# EAGLE design Adafruit Sparkle Motion Stick (EAGLE 9.6.2)
COMPANY: ADAFRUIT INDUSTRIES; DRAWN: KTOWN; REV: B
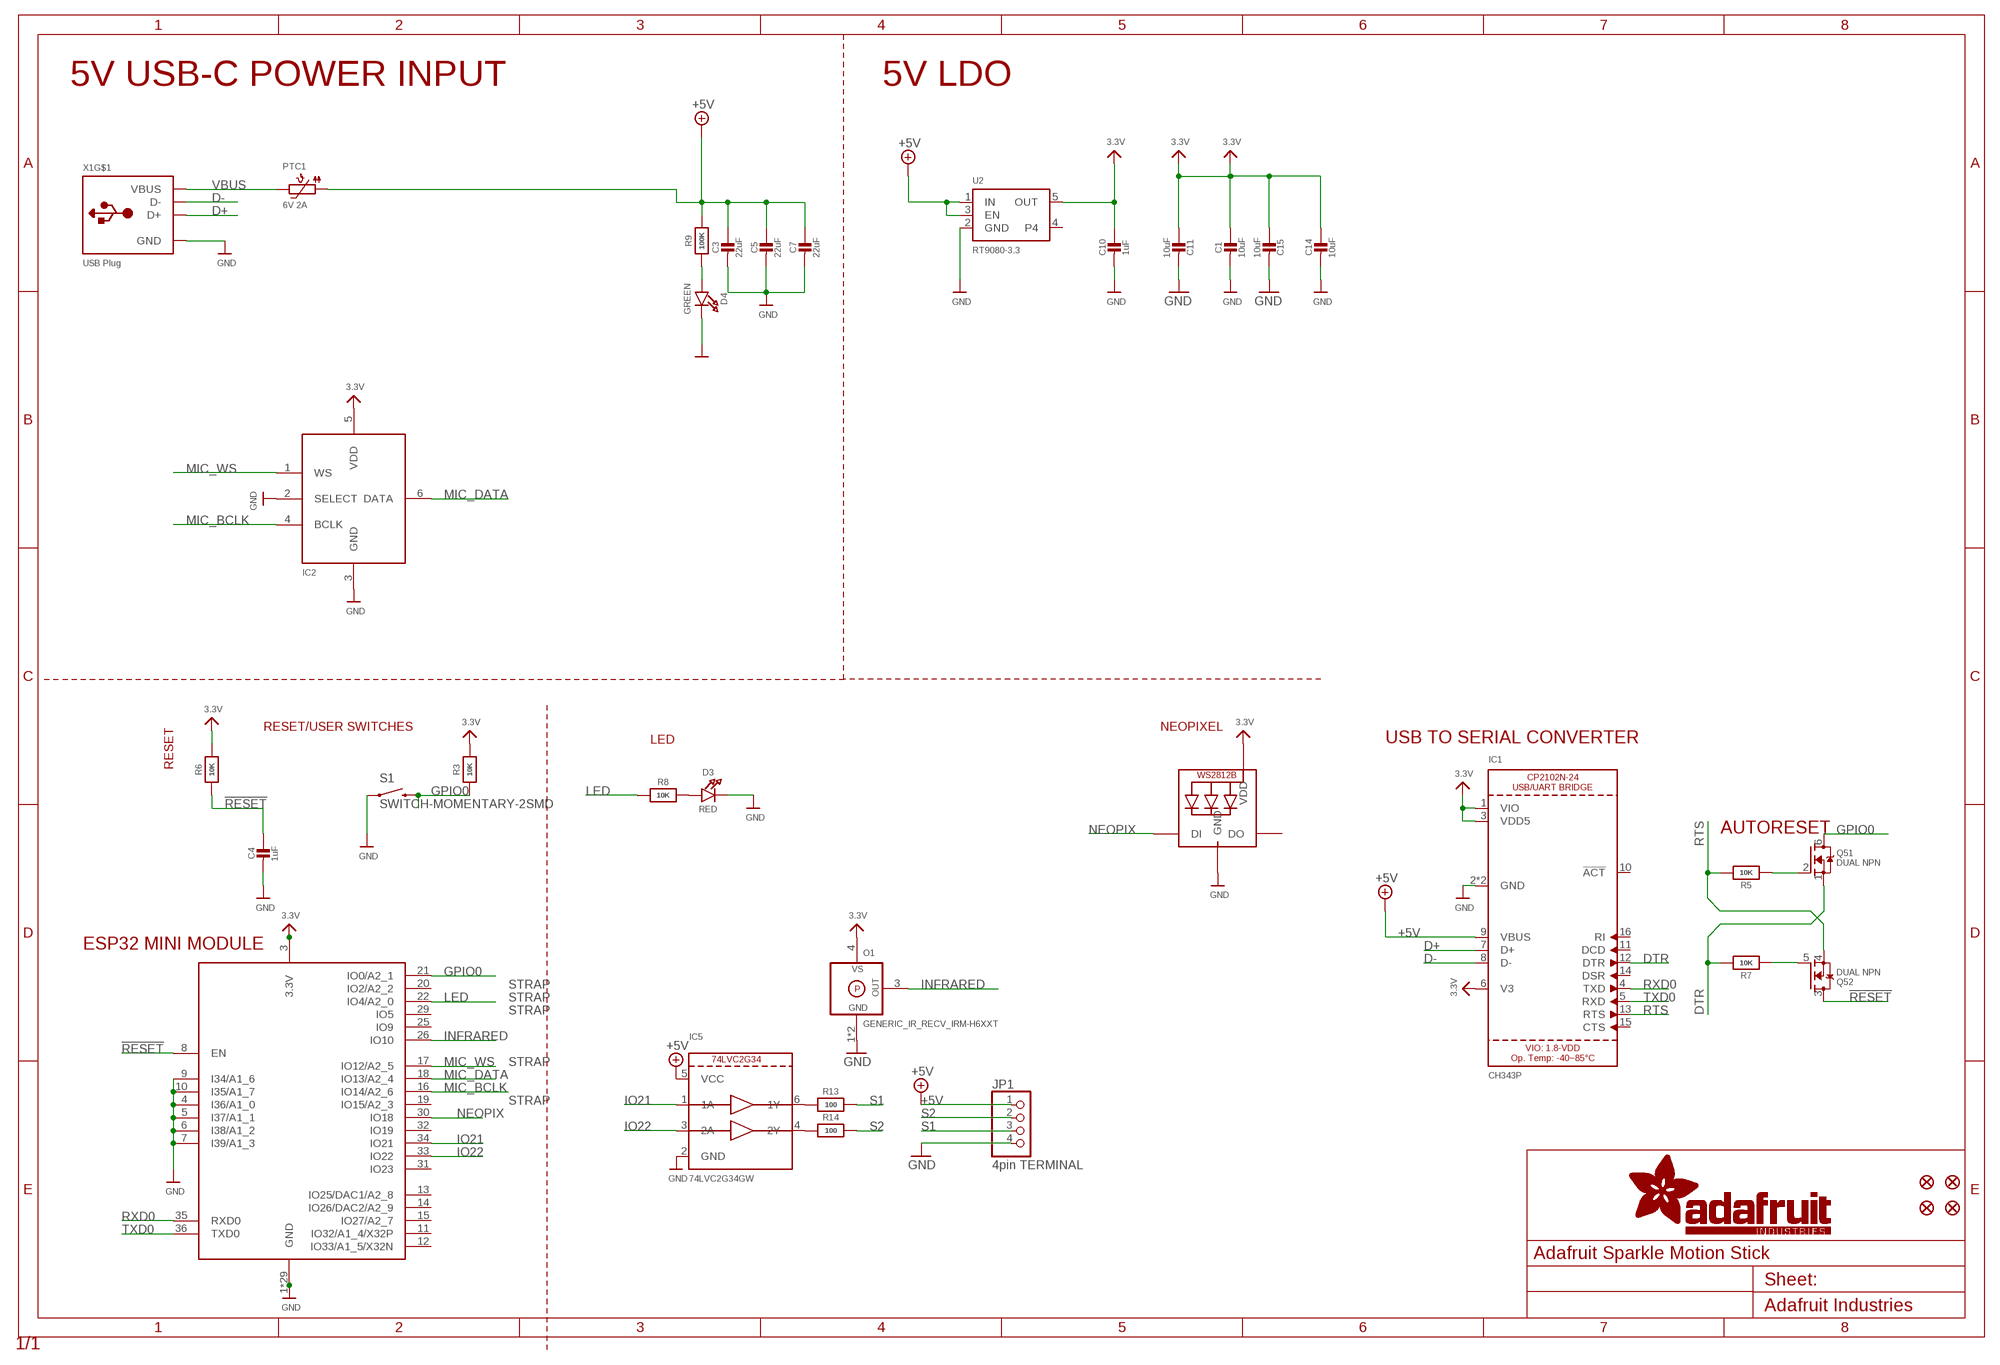
[diagram p0: schematic, sheet 1]

## Parts
C1  10uF  CAP_CERAMIC0805-NOOUTLINE  [0805-NO]
C3  22uF  CAP_CERAMIC0805-NOOUTLINE  [0805-NO]
C4  1uF  CAP_CERAMIC0603_NO  [0603-NO]
C5  22uF  CAP_CERAMIC0805-NOOUTLINE  [0805-NO]
C7  22uF  CAP_CERAMIC0805-NOOUTLINE  [0805-NO]
C10  1uF  CAP_CERAMIC0603_NO  [0603-NO]
C11  10uF  CAP_CERAMIC0805-NOOUTLINE  [0805-NO]
C14  10uF  CAP_CERAMIC0805-NOOUTLINE  [0805-NO]
C15  10uF  CAP_CERAMIC0805-NOOUTLINE  [0805-NO]
D3  RED  LED0603_NOOUTLINE  [CHIPLED_0603_NOOUTLINE]
D4  GREEN  LED0603_NOOUTLINE  [CHIPLED_0603_NOOUTLINE]
IC1  CH343P  [QFN16_3MM]
IC2  ICS-43434  MIC_I2S_SPH0645  [SPH0645LM4H]
IC5  74LVC2G34GW  [SC70-6L]
JP1  4pin TERMINAL  HEADER-1X4_254MMTERM  [1X04_2.54MMTERMINAL]
LED1  WS2812B_SK6805_1515  [SK6805_1515]
O1  GENERIC_IR_RECV_IRM-H6XXT  [IRM-H6XXT]
PTC1  6V 2A  PTC_0805  [0805-NO]
Q5  DUAL NPN  MOSFET-N_DUAL  [SOT363]
R3  10K  RESISTOR_0603_NOOUT  [0603-NO]
R5  10K  RESISTOR_0603_NOOUT  [0603-NO]
R6  10K  RESISTOR_0603_NOOUT  [0603-NO]
R7  10K  RESISTOR_0603_NOOUT  [0603-NO]
R8  10K  RESISTOR_0603_NOOUT  [0603-NO]
R9  100K  RESISTOR_0603_NOOUT  [0603-NO]
R13  100  RESISTOR_0603_NOOUT  [0603-NO]
R14  100  RESISTOR_0603_NOOUT  [0603-NO]
S1  SWITCH-MOMENTARY-2SMD  [TACTILE_SWITCH_SMD]
U2  RT9080-3.3  VREG_SOT23-5  [SOT23-5]
U$23  FIDUCIAL_0.5MM  [FIDUCIAL_0.5MM]
U$25  FIDUCIAL_0.5MM  [FIDUCIAL_0.5MM]
U$34  FIDUCIAL_0.5MM  [FIDUCIAL_0.5MM]
U$35  FIDUCIAL_0.5MM  [FIDUCIAL_0.5MM]
X1  USB Plug  USB_TYPEA_UG04DD  [USB_A-UGO4DD]
X4  ESP32-MINI-1  [ESP32-MINI-1]

## Nets
3.3V: C1.1 C10.1 C11.1 C14.1 C15.1 IC1.1(VIO) IC1.3(VDD5) IC1.6(V3) IC2.5(VDD) LED1.2(VDD) O1.4(VS) R3.2 R6.2 U2.5(OUT) X4.3(3.3V)
!RESET: C4.1 Q5.3(2:D) R6.1 X4.8(EN)
+5V: C3.1 C5.1 C7.1 IC1.9(VBUS) IC5.5(VCC) JP1.1 PTC1.1 R9.2 U2.1(IN) U2.3(EN)
D+: IC1.7(D+) X1.D+
D-: IC1.8(D-) X1.D-
DTR: IC1.12(DTR) Q5.1(1:S) R7.2
GND: C1.2 C3.2 C4.2 C5.2 C7.2 C10.2 C11.2 C14.2 C15.2 D3.C D4.C IC1.2(GND) IC1.THERMAL(GND) IC2.2(SELECT) IC2.3(GND) IC5.2(GND) JP1.4 LED1.4(GND) O1.1(GND) O1.2(GND) S1.1 U2.2(GND) X1.GND X4.1(GND) X4.2(GND) X4.4(I36/A1_0) X4.5(I37/A1_1) X4.6(I38/A1_2) X4.7(I39/A1_3) X4.9(I34/A1_6) X4.10(I35/A1_7) X4.27(GND) X4.38(GND) X4.39(GND) X4.40(GND) X4.41(GND) X4.42(GND) X4.43(GND) X4.44(GND) X4.45(GND) X4.46(GND) X4.47(GND) X4.48(GND) X4.49(GND) X4.50(GND) X4.51(GND) X4.52(GND) X4.53(GND) X4.54(GND) X4.55(GND) X4.56(GND) X4.57(GND) X4.58(GND) X4.59(GND) X4.60(GND) X4.61(GND) X4.62(GND) X4.63(GND)
GPIO0: Q5.6(1:D) R3.1 S1.3 X4.21(IO0/A2_1)
INFRARED: O1.3(OUT) X4.26(IO10)
IO21: IC5.1(1A) X4.34(IO21)
IO22: IC5.3(2A) X4.33(IO22)
LED: R8.1 X4.22(IO4/A2_0)
MIC_BCLK: IC2.4(BCLK) X4.16(IO14/A2_6)
MIC_DATA: IC2.6(DATA) X4.18(IO13/A2_4)
MIC_WS: IC2.1(WS) X4.17(IO12/A2_5)
N$1: D3.A R8.2
N$2: D4.A R9.1
N$7: Q5.5(2:G) R7.1
N$8: Q5.2(1:G) R5.1
N$10: IC5.6(1Y) R13.1
N$11: IC5.4(2Y) R14.1
NEOPIX: LED1.1(DI) X4.30(IO18)
RTS: IC1.13(RTS) Q5.4(2:S) R5.2
RXD0: IC1.4(TXD) X4.35(RXD0)
S1: JP1.3 R13.2
S2: JP1.2 R14.2
TXD0: IC1.5(RXD) X4.36(TXD0)
VBUS: PTC1.2 X1.VBUS
Unconnected: IC1.10(!ACT) IC1.11(DCD) IC1.14(DSR) IC1.15(CTS) IC1.16(RI) LED1.3(DO) U2.4 X1.MNT1(MT) X1.MNT2(MT) X4.11(IO32/A1_4/X32P) X4.12(IO33/A1_5/X32N) X4.13(IO25/DAC1/A2_8) X4.14(IO26/DAC2/A2_9) X4.15(IO27/A2_7) X4.19(IO15/A2_3) X4.20(IO2/A2_2) X4.25(IO9) X4.29(IO5) X4.31(IO23) X4.32(IO19)

## Notes on the sheet
- 5V USB-C POWER INPUT | 5V LDO
- RESET/USER SWITCHES | NEOPIXEL
- LED | USB TO SERIAL CONVERTER
- RESET
- AUTORESET
- ESP32 MINI MODULE
- STRAP
- STRAP
- STRAP
- STRAP
- STRAP

## Library data of the parts
C1 C3-C5 C7 C10 C11 C14 C15 = microbuilder:CAP_CERAMIC: Ceramic Capacitors For new designs, use the packages preceded by an '_' character since they are more reliable: The following footprints should be used on most boards: _0402 - Standard footprint for regular board layouts _0603 - Standard footprint for regular board layouts _0805 - Standard footprint for regular board layouts _1206 - Standard footprint for regular board layouts For extremely tight-pitch boards where space is at a premium, the following 'micro-pitch' footprints can be used (smaller pads, no silkscreen outline, etc.): _0402MP - Micro-pitch footprint for very dense/compact boards _0603MP - Micro-pitch footprint for very dense/compact boards _0805MP - Micro-pitch footprint for very dense/compact boards _1206MP - Micro-pitch footprint for very dense/compact boards
D3 D4 = microbuilder:LED: LED 0603 - 0603 Surface Mount Package 2mA: Green LED - Low Power (3.9mcd, 2ma, 1.7Vf) - Digikey: 475-2709-2-ND Orange LED - Low Power (9.8mcd, 2ma, 1.8Vf) - Digikey: 475-1194-2-ND Red LED - Low Power (5mcd, 2ma, 1.8Vf) - Digikey: 475-1195-2-ND Yellow LED - Low Power (7mcd, 2ma, 1.8Vf) - Digikey: 475-1196-2-ND 5mA: Blue LED - Low Power (17mcd, 5ma, 2.9Vf) - Digikey: LNJ937W8CRACT-ND 0805 - 0805 Surface Mount Package 2mA: Red LED (8.8mcd, 2mA, 1.8Vf, Clear) - Low Power [Digikey: 475-2510-1-ND] Green LED (5mcd, 2mA, 1.8Vf, Clear) - Low Power [Digikey: 475-2730-1-ND] Yellow LED (11.3mcd, 2mA, 1.8Vf, Clear) - Low Power [Digikey: 475-2555-1-ND] 20mA: Red LED (104mcd, 20mA, Diffused) - LS R976 [Digikey: 475-1278-6-ND] Red LED (12mcd, 20mA, 2.0Vf, Clear) - APT2012EC [Digikey: 754-1128-1-ND] Green LED (15mcd, 20mA, 2.2Vf, Clear) - APT2012GC [Digikey: 754-1131-1-ND] Orange LED (160mcd, 20mA, 2.1Vf, Clear) - APT2012SECK [Digikey: 754-1130-1-ND] 1206 - 1206 Surface Mount Package Green LED (26mcd, 20mA, Diffused) - LG N971 [Digikey: 475-1407-6-ND] Red LED (15mcd, 20mA, Diffused) - LH N974 [Digikey: 475-1416-6-ND] Cree - Cree High-Power Surface Mount LEDs XPEBWT-L1-0000-00D50 - White 111lm 350mA 2.9Vf 6200K 110° XTEAWT-00-0000-00000LEE3 - White 114lm 350mA 2.85Vf 5000K 115° Everlight - Everlight 45-21 Series Surface Mount LEDs 45-21/QK2C-B2832AC2CB2/2T - Warm White 2000mcd 20mA 3.25Vf 3050K 120° 45-21/LK2C-B38452C4CB2/2T - Nuetral White 2000mcd 20mA 3.25Vf 4150K 120° 45-21/LK2C-B50634C6CB2/2T - Cold White 2200mcd 20mA 3.25Vf 5650K 120° PLCC2 Reverse Mount LS T77K-J1L2-1-0-2-R18-Z - Red 11.25mcd 2mA 1.8Vf 630nm 120° LO T77K-L1M2-24-Z - Orange 19.6mcd 2mA 1.8Vf 606nm 120° LY T77K-K2M1-26-Z - Yellow 15.7mcd 2mA 1.8Vf 587nm 120°; ROT: 270
IC1 = microbuilder:CH343P
IC2 = microbuilder:MIC_I2S
IC5 = microbuilder:74LVC2G34
JP1 = microbuilder:HEADER-1X4: PIN HEADER
LED1 = microbuilder:WS2812B; LCSC: C2890035
O1 = adafruit_sensor:GENERIC_IR_RECV
PTC1 = microbuilder:PTC: PTC (Resettable Fuse) 1206 Package 250mA PTC (16V Max, Time-to-Trip: 0.08s) - Digikey: F2110CT-ND 1210 Package 100mA PTC (30V Max, Time-to-Trip: 0.6s) - Digikey: MF-USMF010-2CT-ND 1812 Package 750mA PTC (24V Max, Time-to-Trip: 0.2s) - Digikey: MF-MSMF075/24-2CT-ND
Q5 = microbuilder:MOSFET-N_DUAL: Dual N-Channel MOSFET SOT363 (2.0x1.25mm) 2N7002PS - 60V, 320mA [Digikey: 568-5984-1-ND]; JLC_ROTATION: 90
R3 R5-R9 R13 R14 = microbuilder:RESISTOR: Resistors For new designs, use the packages preceded by an '_' character since they are more reliable: The following footprints should be used on most boards: _0402 - Standard footprint for regular board layouts _0603 - Standard footprint for regular board layouts _0805 - Standard footprint for regular board layouts _1206 - Standard footprint for regular board layouts For extremely tight-pitch boards where space is at a premium, the following 'micro-pitch' footprints can be used (smaller pads, no silkscreen outline, etc.): _0402MP - Micro-pitch footprint for very dense/compact boards _0603MP - Micro-pitch footprint for very dense/compact boards _0805MP - Micro-pitch footprint for very dense/compact boards _1206MP - Micro-pitch footprint for very dense/compact boards
S1 = SparkFun:SWITCH-MOMENTARY-2
U2 = adafruit_power:VREG_SOT23-5: SOT23-5 Fixed Voltage Regulators Part Current Out V Out V In V Dropout θJA (°C/W) TJ (°C) Digikey Part No. ADP121 150mA 3.3V 3.4-5.5V 0.09V @ 150mA -- -- ADP121-AUJZ33R7CT-ND ADP121 150mA 3.0V 3.1-5.5V 0.09V @ 150mA -- -- ADP121-AUJZ30R7CT-ND ADP122 300mA 3.3V 3.4-5.5V 0.085V @ 300mA -- -- ADP122AUJZ-3.3-R7CT-ND ADP1712 300mA 3.3V 3.5-5.5V 0.17V @ 300mA -- -- ADP1712AUJZ-3.3-R7TR-ND AP7311 (Low Cost) 150mA 3.3V 3.5-6V 0.15V @ 150mA -- -- AP7311-33WG-7DICT-ND LD39015M18R 150mA 1.8V 1.9V-5.5V 0.08V @ 100mA -- -- 497-6977-1-ND LP2985A-33DBVR 150mA 3.3V 3.3-16V 0.28V @ 150mA 206 150 296-18479-1-ND MCP1824T-3302E/OT 300mA 3.3V 3.5V-6V 0.2V @ 300mA -- -- MCP1824T-3302E/OTCT-ND MIC5205-2.5YM5 TR 150mA 2.5V 2.7-16V 0.165V @ 150mA -- -- 576-1257-2-ND MIC5205-3.0YM5 TR 150mA 3.0V 3.2V-16V 0.165V @ 150mA -- -- 576-1258-2-ND MIC5205-3.3YM5 TR 150mA 3.3V 3.5V-16V 0.165V @ 150mA -- -- 576-1259-2-ND TPS780330220 150mA 3.3V+2.2V 3.6-5.5V 250mV Max -- -- 296-23332-1-ND TDA3663/N1,135 100mA 3.3V 3.5-45V 0.18V @ 50mA -- -- 568-5343-1-ND Max operating temp can be calculated using θJA, TJ (max junction temperature), and power in watts. Set the "Maximum Ambient Temperature" until it reaches TJ ("Max Junction Temperature"), which is the absolute limit for safe use of the regulator: Heat Sink Temperature Calculator <http://www.daycounter.com/Calculators/Heat-Sink-Temperature-Calculator.phtml> For example, With 12V source into a 3.3V LP2985 and a 30mA load, we are dissipating (12V-3.3V) * 0.03A = 0.261W. With a θJA of 206 °C/W, a TJ of 150°C, and 261mW we can safely use the chip without a heat sink up to 75°C (=147.1°C Junction Temperature).; JLC_ROTATION: 0
U$23 U$25 U$34 U$35 = microbuilder:FIDUCIAL: Fiducial Alignment Points Various fiducial points for machine vision alignment.
X1 = adafruit_electromech:USB_TYPEA: USB - Type A Connectors Male types stick out and are inserted into a PC or matching females parts (these are the connectors used on USB Memory Sticks, etc.). Female parts are generally used for USB Host and accept a male-type connector. SMT - 4UCON: 10017 PTHFML - Digikey: 609-1045-ND, 4UCon: 05241 PCB - Use 2.0mm thick PCBs with this footprint
X4 = adafruit_wireless:ESP32-MINI-1

## Net classes
1 power: width 0.305 mm

## Board
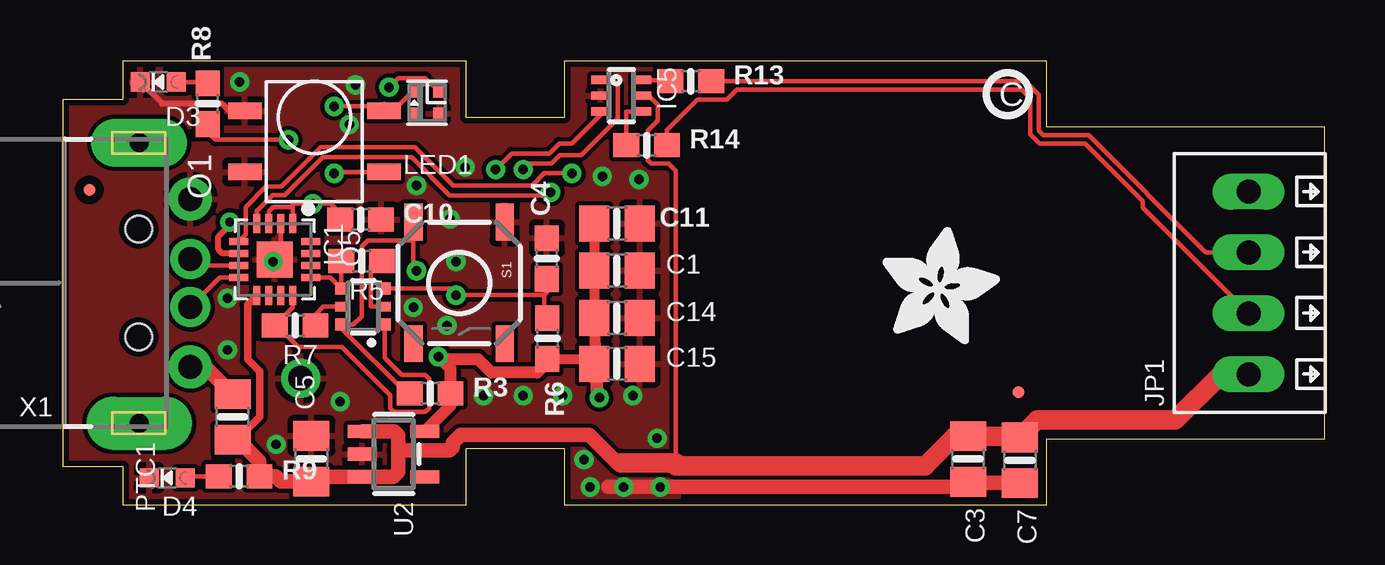
[diagram p1: board, top side]
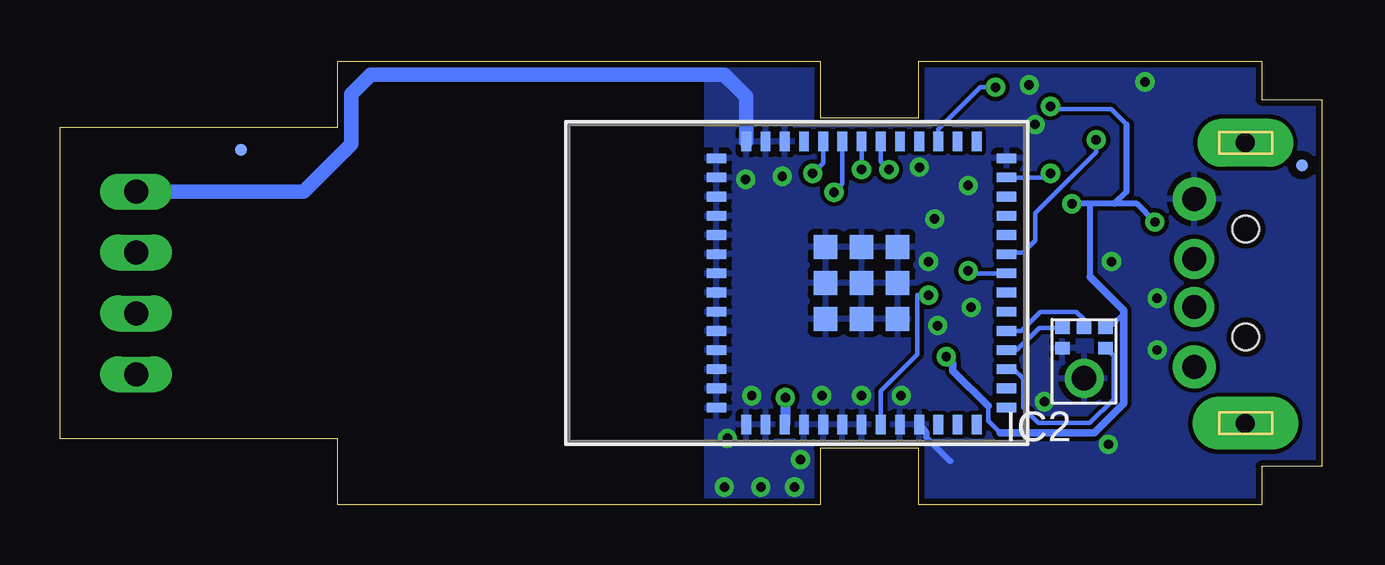
[diagram p2: board, bottom side, seen from below]

Size 52.57 x 18.5 mm. Coordinates in mm from the lower left corner, seen from the top.
Outline: 0,16.9 0,1.6 2.5,1.6 2.5,0 16.8,0 16.8,2.35 20.9,2.35 20.9,0 41,0 41,2.75 52.57,2.75 52.57,15.75 41,15.75 41,18.5 20.9,18.5 20.9,16.15 16.8,16.15 16.8,18.5 2.5,18.5 2.5,16.9 0,16.9
Copper layers (1*16): Top 0.035mm / dielectric 1.5mm / Bottom 0.035mm
Design rules "adafruit 7-7": minimum track width 7mil, minimum drill 15.5mil, track to track 7mil, track to pad 7mil, pad to pad 7mil, via to via 7mil, smd to smd 7mil, copper to edge 10mil, drill to drill 8mil, minimum pad ring 10mil, minimum via ring 8mil, stop-mask expansion 2mil, vias tented up to drill 20mil, thermal gap 10mil

### Footprints (pad centres in the part's own frame; a part is rotated, then mirrored left to right if it is on the bottom)
0805-NO = smd 1.24 x 1.5: 1 -0.95,0; 2 0.95,0
0603-NO = smd 1.075 x 1: 1 -0.85,0; 2 0.85,0
CHIPLED_0603_NOOUTLINE = smd 0.8 x 0.8: A 0,-0.75; C 0,0.75
QFN16_3MM = smd 0.8 x 0.28: 1 -1.5,0.75; 2 -1.5,0.25; 3 -1.5,-0.25; 4 -1.5,-0.75; 9 1.5,-0.75; 10 1.5,-0.25; 11 1.5,0.25; 12 1.5,0.75 | smd 0.28 x 0.8: 5 -0.75,-1.5; 6 -0.25,-1.5; 7 0.25,-1.5; 8 0.75,-1.5; 13 0.75,1.5; 14 0.25,1.5; 15 -0.25,1.5; 16 -0.75,1.5 | smd 1.5 x 1.5: THERMAL 0,0
SPH0645LM4H = smd 0.6 x 0.525: 1 -0.9,1.4; 2 -0.9,0.55; 4 0.9,0.55; 5 0.9,1.4; 6 0,1.4 | drill 1.025 pad 1.625: 3 0,-0.71
SC70-6L = smd 0.35 x 0.8: 1 -0.65,-0.85; 2 0,-0.85; 3 0.65,-0.85; 4 0.65,0.85; 5 0,0.85; 6 -0.65,0.85
1X04_2.54MMTERMINAL = drill 1 long: 1 -3.81,0; 2 -1.27,0; 3 1.27,0; 4 3.81,0
SK6805_1515 = smd 0.5 x 0.5: 1 -0.5,-0.45; 2 0.5,-0.45; 3 0.5,0.45; 4 -0.5,0.45
IRM-H6XXT = smd 0.7 x 1.4: 1 1.27,2.9; 2 -1.27,2.9; 3 -1.27,-2.9; 4 1.27,-2.9
SOT363 = smd 0.5 x 0.5: 1 -0.75,-0.9; 3 0.75,-0.9; 4 0.75,0.9; 6 -0.75,0.9 | smd 0.4 x 0.5: 2 0,-0.9; 5 0,0.9
TACTILE_SWITCH_SMD = smd 1.524 x 0.762: 1 -2.54,1.905; 2 2.54,1.905; 3 -2.54,-1.905; 4 2.54,-1.905
SOT23-5 = smd 0.55 x 1.2: 1 -0.95,-1.3; 2 0,-1.3; 3 0.95,-1.3; 4 0.95,1.3; 5 -0.95,1.3
FIDUCIAL_0.5MM = smd 0.5 x 0.5: 1 0,0
USB_A-UGO4DD = drill 1 pad 1.676: D+ -1,2.15; D- 1,2.15 | drill 1 pad 1.778: GND -3.5,2.15; VBUS 3.5,2.15 | drill 0.8 pad 2.2 long: MNT1 5.85,0.02 | drill 0.8 pad 2 long: MNT2 -5.85,0.02 | hole 1.1: 2.25,0; -2.25,0
ESP32-MINI-1 = smd 0.813 x 0.406: 1 -5.9,4.9; 2 -5.9,4.1; 3 -5.9,3.3; 4 -5.9,2.5; 5 -5.9,1.7; 6 -5.9,0.9; 7 -5.9,0.1; 8 -5.9,-0.7; 9 -5.9,-1.5; 10 -5.9,-2.3; 11 -5.9,-3.1; 12 -5.9,-3.9; 13 -5.9,-4.7; 28 5.9,-4.7; 29 5.9,-3.9; 30 5.9,-3.1; 31 5.9,-2.3; 32 5.9,-1.5; 33 5.9,-0.7; 34 5.9,0.1; 35 5.9,0.9; 36 5.9,1.7; 37 5.9,2.5; 38 5.9,3.3; 39 5.9,4.1; 40 5.9,4.9 | smd 0.406 x 0.813: 14 -5.2,-5.95; 15 -4.4,-5.95; 16 -3.6,-5.95; 17 -2.8,-5.95; 18 -2,-5.95; 19 -1.2,-5.95; 20 -0.4,-5.95; 21 0.4,-5.95; 22 1.2,-5.95; 23 2,-5.95; 24 2.8,-5.95; 25 3.6,-5.95; 26 4.4,-5.95; 27 5.2,-5.95; 41 5.2,6.15; 42 4.4,6.15; 43 3.6,6.15; 44 2.8,6.15; 45 2,6.15; 46 1.2,6.15; 47 0.4,6.15; 48 -0.4,6.15; 49 -1.2,6.15; 50 -2,6.15; 51 -2.8,6.15; 52 -3.6,6.15; 53 -4.4,6.15; 54 -5.2,6.15 | smd 0.991 x 0.991: 55 -1.5,1.6; 56 0,1.6; 57 1.5,1.6; 58 -1.5,0.1; 59 0,0.1; 60 1.5,0.1; 61 -1.5,-1.4; 62 0,-1.4; 63 1.5,-1.4

### Placement (x,y rotation side)
C1  23.09,9.77 0 top
C3  37.72,1.91 270 top
C4  20.17,10.27 90 top
C5  10.35,1.92 90 top
C7  39.88,1.86 270 top
C10  12.41,11.89 0 top
C11  23.09,11.73 0 top
C14  23.09,7.79 0 top
C15  23.09,5.88 0 top
D3  3.98,17.63 90 top
D4  4.34,1.12 90 top
E$1  [ADAFRUIT_5MM]  34.16,6.71 0 top
IC1  8.83,10.23 270 top
IC2  9.9,5.98 0 bottom
IC5  23.27,17.06 270 top
JP1  49.4,9.25 90 top
LED1  15.18,16.77 180 top
O1  10.48,15.15 90 top
PLABEL0  [PLABEL0]  15.47,12.55 0 top
PLABEL1  [PLABEL1]  6.95,14.65 0 top
PLABEL2  [PLABEL2]  26.1,12.43 0 top
PLABEL3  [PLABEL3]  43.54,5.38 0 top
PLABEL4  [PLABEL4]  12.32,16.7 0 top
PLABEL5  [PLABEL5]  11.43,5.4 0 top
PLABEL6  [PLABEL6]  40.04,12.49 0 top
PLABEL7  [PLABEL7]  42.14,7.09 0 top
PLABEL8  [PLABEL8]  42.2,9.82 0 top
PLABEL9  [PLABEL9]  5.78,1.78 90 top
PLABEL10  [PLABEL10]  6.69,12.36 0 top
PLABEL11  [PLABEL11]  16.6,14.65 0 top
PLABEL12  [PLABEL12]  13.55,14.65 0 top
PLABEL13  [PLABEL13]  4.51,16.32 90 top
PLABEL14  [PLABEL14]  26.03,0.7 0 top
PLABEL15  [PLABEL15]  35.94,9.25 90 bottom
PLABEL16  [PLABEL16]  46.1,13.06 0 bottom
PLABEL17  [PLABEL17]  46.23,10.52 0 bottom
PLABEL18  [PLABEL18]  46.23,7.98 0 bottom
PLABEL19  [PLABEL19]  46.35,5.31 0 bottom
PLABEL20  [PLABEL20]  8.64,11.92 90 bottom
PLABEL21  [PLABEL21]  8.51,2.39 0 bottom
PTC1  7.07,3.66 90 top
Q5  12.51,8.26 90 top
R3  15.3,4.64 0 top
R5  12.45,10.16 180 top
R6  20.19,6.93 270 top
R7  9.68,7.47 180 top
R8  6.03,16.72 90 top
R9  7.34,1.19 0 top
R13  26.16,17.66 0 top
R14  24.32,14.99 0 top
S1  16.51,9.25 270 top
U2  13.78,2.11 270 top
U$10  [PCBFEAT-REV-040]  39.37,17.12 0 top
U$23  45.02,14.8 0 bottom
U$25  0.82,14.16 0 bottom
U$34  39.81,4.7 270 top
U$35  1.1,13.13 270 top
X1  3.16,9.25 270 top
X4  19.07,9.25 90 bottom

### Tracks (layer width: path | path; a pad name or v marks a point on that pad's centre or on a via)
3.3V  (via drill 0.39)
  Top 0.178: LED1.2 14.55,17.22 13.72,16.39 13.38,16.72 O1.4 13.19,16.62 v11.3,16.62 | 9.58,12.43 9.58,12.55 v10.41,12.55 11.15,12.55 11.56,12.15 C10.1 | 9.58,12.43 IC1.1 | IC1.3 8.58,12.24 8.76,12.43 9.58,12.43 | v15.64,6.18 15.81,6.01
  Top 0.254: v6.95,11.79 6.95,11.66 6.48,11.19 6.48,10.65 6.65,10.48 IC1.6
  Top 0.406: 22.12,6.08 22.21,6.08 C14.1 22.31,4.51 v22.35,4.46 22.22,4.6 C15.1 | 22.12,6.08 22.14,6.09 C1.1 C11.1 | R6.2 20.32,6.08 22.12,6.08
  Top 0.508: 20.32,6.08 19.76,5.52 17.86,5.52 17.3,6.08 15.88,6.08 15.81,6.01 16.15,5.67 R3.2 16.15,4.14 U2.5
  Bottom 0.178: 10.29,12.55 v10.41,12.55 | 8.13,15.85 8.76,16.49 11.18,16.49 v11.3,16.62 | 13.4,3 13.9,3.5 13.9,4.12 | IC2.5 8.85,7.38 8.26,7.98
  Bottom 0.254: v6.95,11.79 7.71,12.55 8.64,12.55 | 8.64,12.55 9.65,12.55 | 9.65,12.55 10.29,12.55 | 8.64,12.55 8.13,13.06 8.13,15.85 | 9.65,9.5 9.65,12.55
  Bottom 0.305: v15.64,6.18 15.37,5.9 15.37,5.58 13.9,4.12 | 13.4,3 9.49,3 8.26,4.23 8.26,7.98 8.26,8.11 9.65,9.5
  Bottom 0.406: v22.35,4.46 22.35,3.37 X4.3
!RESET  (via drill 0.39)
  Top 0.178: 20.07,8.74 20.17,8.84 C4.1 | 20.07,8.74 v16.38,8.74 16.12,9.01 Q5.3 | R6.1 20.07,7.9 20.07,8.74
  Bottom 0.178: X4.8 18.38,4.75 16.85,6.27 16.85,8.74 v16.38,8.74
+5V
  Top 0.178: IC5.5 24.42,17.06 24.78,16.7 24.78,16.02 24.37,15.6 24.37,14.35 24.4,14.35 24.52,14.22 25.25,14.22 25.54,13.93 25.54,1.76 25.54,1.63
  Top 0.305: PTC1.1 7.26,2.71 8.2,3.66 8.2,5.55 7.7,6.06 7.7,8.35 IC1.9
  Top 0.61: U2.1 13.81,3.06 13.97,2.9 13.97,2.26 | 13.97,2.26 13.97,1.38 13.76,1.16 U2.3 10.54,1.16 C5.1 9.08,0.97 8.87,1.19 R9.2 8.19,1.82 7.3,2.71 PTC1.1 | 13.97,2.26 16.11,2.26 16.24,2.39 16.24,2.58 16.57,2.91 21.94,2.91 23.09,1.76 23.24,1.76
  Top 0.813: JP1.1 48.26,5.44 46.35,3.54 40.6,3.54 C7.1 39.83,2.86 C3.1 37.17,2.86 35.94,1.63 25.54,1.63 | 23.24,1.76 25.54,1.76
D+
  Top 0.178: IC1.7 5.58,9.98 X1.D+
D-
  Top 0.178: IC1.8 6.54,9.48 X1.D-
DTR
  Top 0.178: Q5.1 13.41,6.13 14.13,5.41 15.1,5.41 15.26,5.25 15.26,4.03 15.1,3.87 13.8,3.87 13.65,4.03 13.65,4.56 11.63,6.58 9.8,6.58 8.94,7.45 R7.2 9.58,8.22 IC1.12
GND  (via drill 0.39)
  Top 0.178: IC1.2 9.08,10.23 IC1.THERMAL
  Top 0.254: O1.1 6.95,16.42 6.64,16.73 4.13,16.73 D3.C
  Top 0.61: C7.2 37.77,0.91 C3.2 37.5,0.74 22.73,0.74
  Bottom 0.254: X4.10 16.48,3.06 16.48,2.82 15.48,1.81
  Bottom 0.61: X4.40 23.97,17.02 24.89,17.94 39.62,17.94 40.44,17.12 40.44,15.04 42.42,13.06 JP1.4
  other vias: 16.13,11.92 11.94,15.85 7.37,17.63 8.76,10.14 16,7.47 23.75,4.55 24,13.57 22.48,13.7 24.77,2.77 12.19,17.51 16.38,10.14 21.72,1.88 16.76,14.08 21.97,0.74 24.89,0.74 23.37,0.74 8.89,2.52 11.56,4.3 17.53,4.55 19.18,4.55 20.83,4.55 14.73,13.31 14.61,8.23 6.86,6.46 6.86,8.62
  pour Top: 0,-0.02 25.65,-0.02 25.65,18.52 0,18.52
  pour Bottom: 0,-0.02 25.65,-0.02 25.65,18.52 0,18.52
GPIO0  (via drill 0.39)
  Top 0.178: R3.1 14.33,4.64 11.61,7.36 Q5.6 12.1,7.51 12.45,7.85 12.45,10.77 12.7,11.03 14.61,11.03 | S1.3 14.61,11.03 | 14.61,11.03 14.61,9.88 v14.73,9.76
  Bottom 0.178: v14.73,9.76 14.62,9.65 X4.21
INFRARED  (via drill 0.39)
  Top 0.178: v11.3,13.82 11.37,13.88 O1.3
  Bottom 0.178: X4.26 11.47,13.65 v11.3,13.82
IO21  (via drill 0.39)
  Top 0.178: v19.18,13.98 19.43,14.23 20.35,14.23 20.7,14.58 21.59,14.58 23.11,16.11 23.11,17.51 22.91,17.71 IC5.1
  Bottom 0.178: X4.34 v19.17,13.98 v19.18,13.98
IO22  (via drill 0.39)
  Top 0.178: v18.03,13.98 18.7,14.65 19.45,14.65 19.46,14.64 20.26,14.64 20.68,15.07 21.21,15.07 22.42,16.27 IC5.3
  Bottom 0.178: X4.33 18.38,14.32 v18.03,13.98
LED  (via drill 0.39)
  Top 0.178: v9.4,15.22 6.35,15.22 6.03,15.54 R8.1
  Bottom 0.178: v9.4,15.22 9.4,14.71 11.94,12.17 11.94,11.03 12.45,10.52 13.05,10.52 X4.22
MIC_BCLK
  Bottom 0.178: X4.16 12.83,5.65 12.45,5.27 12.45,4.05 11.81,3.42 9.66,3.42 8.67,4.4 8.67,6.2 IC2.4
MIC_DATA
  Bottom 0.178: X4.18 12.51,7.25 11.72,8.04 10.22,8.04 9.9,7.72 IC2.6
MIC_WS
  Bottom 0.178: X4.17 12.71,6.45 11.77,7.38 IC2.1
N$1
  Top 0.178: R8.2 6.06,17.57 6.12,17.63 D3.A
N$2
  Top 0.178: R9.1 5.16,1.19 D4.A
N$7
  Top 0.178: R7.1 10.53,7.94 10.85,8.26 Q5.5
N$8
  Top 0.178: Q5.2 12.83,8.26 12.83,9.96 R5.1
N$10
  Top 0.178: IC5.6 25.26,17.71 R13.1
N$11
  Top 0.178: IC5.4 24.12,16.39 23.47,16.39 R14.1
NEOPIX  (via drill 0.39)
  Top 0.178: LED1.1 15.1,17.79 13.97,17.79 v13.59,17.41
  Bottom 0.178: X4.30 15.97,15.66 14.22,17.41 v13.59,17.41
RTS
  Top 0.178: R5.2 11.6,9.02 Q5.4 11.14,9.48 IC1.13
RXD0  (via drill 0.39)
  Top 0.178: IC1.4 8.08,12.27 8.11,12.27 8.74,12.91 9.27,12.91 9.27,12.93 10.84,14.5 14.53,14.5 16.13,12.9 20.19,12.9 v20.32,13.03
  Bottom 0.178: X4.35 19.97,13.37 v20.32,13.03
S1
  Top 0.178: R13.2 40.11,17.66 40.66,17.11 40.66,15.61 40.86,15.41 42.74,15.41 47.62,10.52 JP1.3
S2
  Top 0.178: R14.2 25.17,15.62 26.44,16.89 27.66,16.89 28.07,17.3 39.96,17.3 40.3,16.96 40.3,15.46 40.71,15.05 42.59,15.05 44.99,12.65 44.99,12.4 JP1.2
TXD0  (via drill 0.39)
  Top 0.178: v21.21,13.82 20.07,13.82 19.56,13.31 16.26,13.31 14.66,14.91 10.74,14.91 9.1,13.26 8.46,13.26 7.62,12.43 7.62,11.27 IC1.5
  Bottom 0.178: X4.36 20.77,14.26 v21.21,13.82
VBUS
  Top 0.61: PTC1.2 5.95,5.73 5.56,5.73 5.54,5.75 X1.VBUS

### Text on the board
Pinguin_tBackup: 4 | L | IR | Neo | 18 | GND | #0 | 10 | 21 | Sparkle / Motion / Stick | 22 | MIC | 5V | 5 | Mic WS: 12 / Mic SD: 13 / Mic Clk: 14
Pinguin_bBackup: GND | CH343P / USB-Serial | 21 | A WLED-friendly / 5V 2A USB Stick / 2x 5V outputs / ESP32 Mini Module | 22 | 5V | I2S Mic. / ICS-43434